# Altium schematic sheet Power.SchDoc: Power Supply
size A3; Author: Eladio Delgado Mingorance; CompanyName: bq - Mundo Reader; Organization: bq - Mundo Reader; Revision: 1.4; SheetNumber: 8; SheetTotal: 10
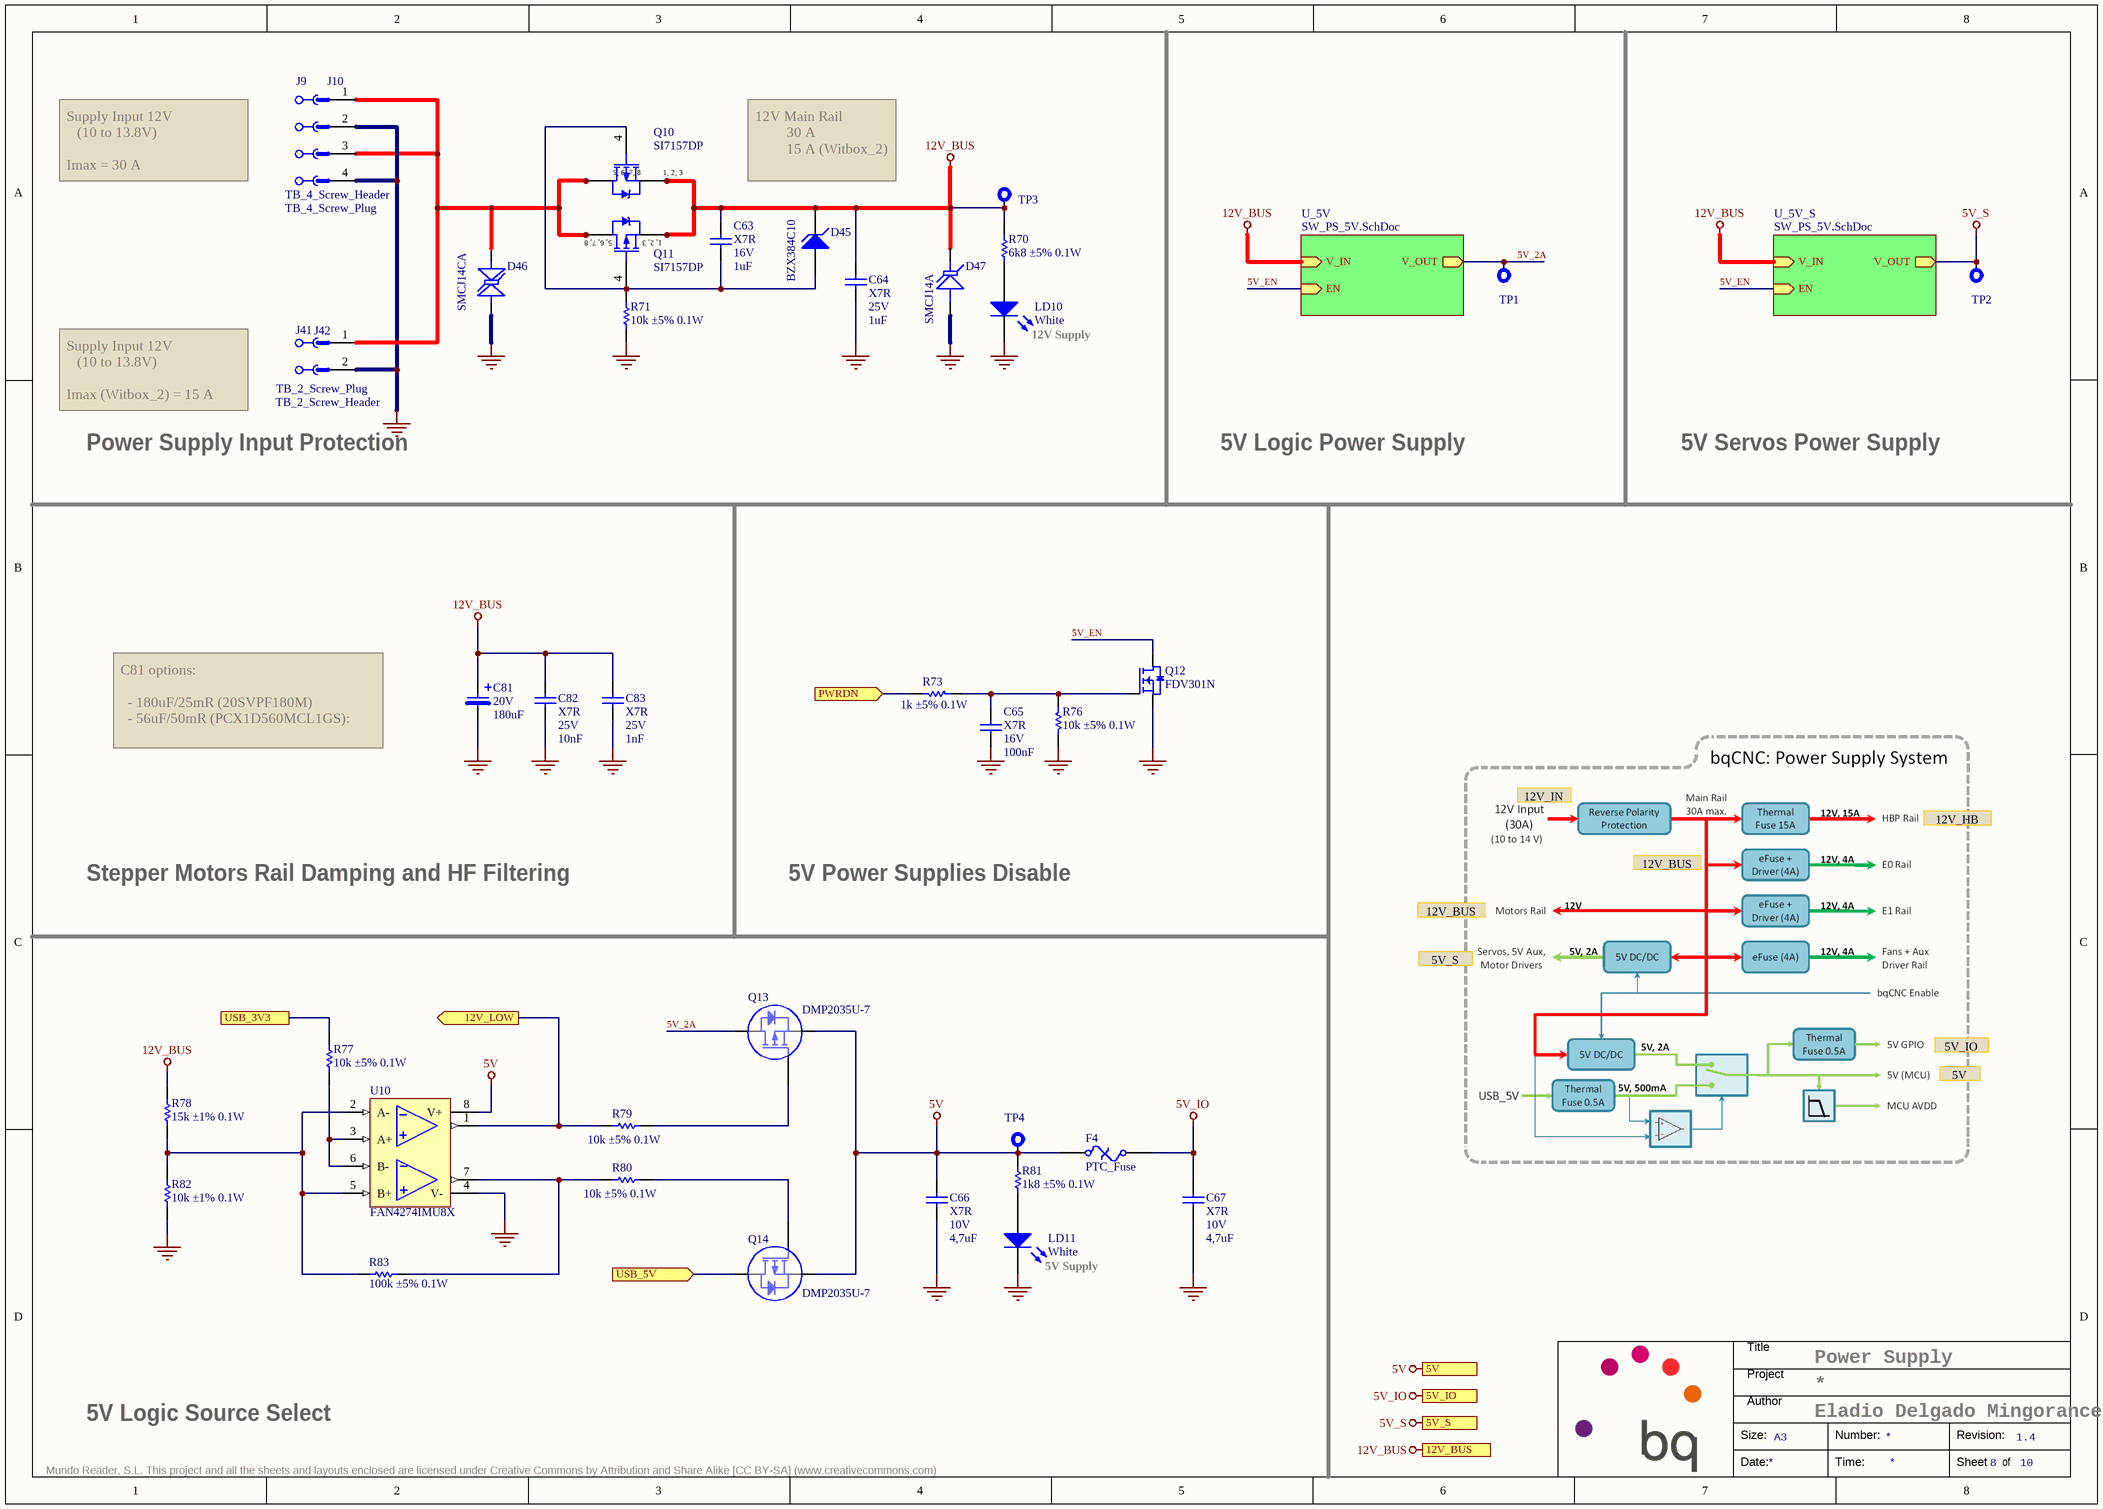
[diagram p0: Power.SchDoc]

## Parts
C63  Dielectric: X7R  Voltage: 16V  Capacitance: 1uF  [C0603]  (hidden comment: Capacitor)
C64  Dielectric: X7R  Voltage: 25V  Capacitance: 1uF  [C0805]  (hidden comment: Capacitor)
C65  Dielectric: X7R  Voltage: 16V  Capacitance: 100nF  [C0603]  (hidden comment: Capacitor)
C66  Dielectric: X7R  Voltage: 10V  Capacitance: 4,7uF  [C0805]  (hidden comment: Capacitor)
C67  Dielectric: X7R  Voltage: 10V  Capacitance: 4,7uF  [C0805]  (hidden comment: Capacitor)
C81  Voltage: 20V  Capacitance: 180uF  [CASE_E7]  (hidden comment: Electrolytic)
C82  Dielectric: X7R  Voltage: 25V  Capacitance: 10nF  [C0603]  (hidden comment: Capacitor)
C83  Dielectric: X7R  Voltage: 25V  Capacitance: 1nF  [C0603]  (hidden comment: Capacitor)
D45  BZX384C10  [SOD323]
D46  SMCJ14CA  [DO-214AB-SMC]
D47  SMCJ14A  [DO-214AB-SMC]
F4  PTC_Fuse  [F1812]
J9  TB_4_Screw_Plug  [TB_RA_4_5.08_Plug]
J10  TB_4_Screw_Header  [TB_RA_4_5.08]
J41  TB_2_Screw_Plug  [TB_RA_2_5.08_Plug]
J42  TB_2_Screw_Header  [TB_RA_2_5.08]
LD10  White  [LED0603]
LD11  White  [LED0603]
Q10  SI7157DP  [AO_DFN5x6]
Q11  SI7157DP  [AO_DFN5x6]
Q12  FDV301N  [SOT23-3]
Q13  DMP2035U-7  [SOT23-3]
Q14  DMP2035U-7  [SOT23-3]
R70  value 6k8 ±5% 0.1W  [R0603]  (hidden comment: Resistor)
R71  value 10k ±5% 0.1W  [R0603]  (hidden comment: Resistor)
R73  value 1k ±5% 0.1W  [R0603]  (hidden comment: Resistor)
R76  value 10k ±5% 0.1W  [R0603]  (hidden comment: Resistor)
R77  value 10k ±5% 0.1W  [R0603]  (hidden comment: Resistor)
R78  value 15k ±1% 0.1W  [R0603]  (hidden comment: Resistor)
R79  value 10k ±5% 0.1W  [R0603]  (hidden comment: Resistor)
R80  value 10k ±5% 0.1W  [R0603]  (hidden comment: Resistor)
R81  value 1k8 ±5% 0.1W  [R0603]  (hidden comment: Resistor)
R82  value 10k ±1% 0.1W  [R0603]  (hidden comment: Resistor)
R83  value 100k ±5% 0.1W  [R0603]  (hidden comment: Resistor)
TP1  Testpoint  [TP_SMD_1mm]  (value not drawn)  (no BOM)
TP2  Testpoint  [TP_SMD_1mm]  (value not drawn)  (no BOM)
TP3  Testpoint  [TP_SMD_1mm]  (value not drawn)  (no BOM)
TP4  Testpoint  [TP_SMD_1mm]  (value not drawn)  (no BOM)
U10  FAN4274IMU8X  [VSSOP8]

## Sub-sheets
U_5V = SW_PS_5V.SchDoc: V_IN (in), V_OUT (out), EN (in)
U_5V_S = SW_PS_5V.SchDoc: V_IN (in), V_OUT (out), EN (in)

## Ports
5V, 5V_IO, 5V_S, 12V_BUS, 12V_LOW (out), PWRDN (in), USB_3V3, USB_5V (in)

## Nets
5V: C66.2 F4.1 Q13.2(S) Q14.2(S) R81.2 TP4.1 U10.8(V+) ; port 5V
5V_IO: C67.2 F4.2 ; port 5V_IO
5V_S: TP2.1 ; port 5V_S, sheet U_5V_S/V_OUT
12V_BUS: C63.2 C64.2 C81.1 C82.2 C83.2 D45.k(K) D47.K Q10.1(S) Q10.2(S) Q10.3(S) Q11.1(S) Q11.2(S) Q11.3(S) R70.2 R78.2 TP3.1 ; port 12V_BUS, sheet U_5V/V_IN, sheet U_5V_S/V_IN
GND: C64.1 C65.1 C66.1 C67.1 C81.2 C82.1 C83.1 D46.A D47.A J10.2 J10.4 J42.2 LD10.K LD11.K Q12.2(S) R71.1 R76.2 R82.1 U10.4(V-)
5V_2A: Q13.3(D) TP1.1 ; sheet U_5V/V_OUT
5V_EN: Q12.3(D) ; sheet U_5V/EN, sheet U_5V_S/EN
12V_LOW: R79.2 U10.1(OutA) ; port 12V_LOW
PWRDN: R73.2 ; port PWRDN
USB_3V3: R77.2 ; port USB_3V3
USB_5V: Q14.3(D) ; port USB_5V
NetC63_1: C63.1 D45.A Q10.4(G) Q11.4(G) R71.2
NetC65_2: C65.2 Q12.1(G) R73.1 R76.1
NetD46_K: D46.K J10.1 J10.3 J42.1 Q10.5(D) Q10.6(D) Q10.7(D) Q10.8(D) Q11.5(D) Q11.6(D) Q11.7(D) Q11.8(D)
NetLD10_A: LD10.A R70.1
NetLD11_A: LD11.A R81.1
NetQ13_1: Q13.1(G) R79.1
NetQ14_1: Q14.1(G) R80.1
NetR77_1: R77.1 U10.3(A+) U10.6(B-)
NetR78_1: R78.1 R82.2 R83.1 U10.2(A-) U10.5(B+)
NetR80_2: R80.2 R83.2 U10.7(OutB)

## Notes on the sheet
- Supply Input 12V
  (10 to 13.8V)
  Imax = 30 A
- 12V Main Rail
  30 A
  15 A (Witbox_2)
- (near LD10) 12V Supply
- Supply Input 12V
  (10 to 13.8V)
  Imax (Witbox_2) = 15 A
- Power Supply Input Protection
- 5V Logic Power Supply
- 5V Servos Power Supply
- C81 options:
  - 180uF/25mR (20SVPF180M)
  - 56uF/50mR (PCX1D560MCL1GS):
- 12V_IN
- 12V_HB
- Stepper Motors Rail Damping and HF Filtering
- 5V Power Supplies Disable
- 12V_BUS
- 5V_S
- 5V_IO
- 5V
- (near LD11) 5V Supply
- 5V Logic Source Select
- Title
- Project
- Size:
- Author
- A3
- Number:
- Revision:
- Mundo Reader, S.L. This project and all the sheets and layouts enclosed are licensed under Creative Commons by Attribution and Share Alike [CC BY-SA] (www.creativecommons.com)
- Date:
- Time:
- Sheet
- of
- (in symbol SI7157DP) 5, 6, 7, 8; 1, 2, 3

## Library data of the parts
C63 = C0603_1uF_16V_±10%_X7R: Manufacturer: TDK; Value: 1uF ±10% 16V; Tolerance: ±10%; OrderingCode: C1608X7R1C105K080AC; Temp_ Max: 125; Temp_ Min: -55; OrderingCode 2: C0603C105K4RACTU; Part Number: C0603_1uF_16V_±10%_X7R; Price (€): 0,018; Manufacturer 2: Kemet
C64 = C0805_1uF_25V_X7R: Manufacturer: TDK; Value: 1uF ±10% 25V; Tolerance: ±10%; OrderingCode: C2012X7R1E105K125AB; Temp_ Max: 125; Temp_ Min: -55; Part Number: C0805_1uF_25V_X7R; Price (€): 0,024
C65 = C0603_100nF_16V_±10%: Manufacturer: Kemet; Value: 100nF ±10% 16V; Tolerance: ±10%; OrderingCode: C0603C104K4RAC; Temp_ Max: 125; Temp_ Min: -55; Part Number: C0603_100nF_16V_±10%; Price (€): 0,012
C66 C67 = C0805_4,7uF_10V_X7R: Manufacturer: TDK; Value: 4,7uF ±10% 10V; Tolerance: ±10%; OrderingCode: C2012X7R1A475K125AC; Temp_ Max: 125; Temp_ Min: -55; Part Number: C0805_4,7uF_10V_X7R; Price (€): 0,041
C81 = Cap_Al_180uF_20V: Capacitor, Electrolytic, SMD; Manufacturer: Panasonic; Value: 180uF 20V; OrderingCode: 20SVPF180M; Temp_ Max: 105; Temp_ Min: -55; Part Number: Cap_Al_180uF_20V; Price (€): 0,69
C82 = C0603_10nF_25V_±10%: Capacitor SMD; Manufacturer: Kemet; Value: 10nF ±10% 25V; Tolerance: ±10%; OrderingCode: C0603C103K3RAC; Temp_ Max: 125; Temp_ Min: -55; Part Number: C0603_10nF_25V_±10%; Price (€): 0,035
C83 = C0603_1nF_25V_±10%: Capacitor SMD; Manufacturer: Kemet; Value: 1nF ±10% 25V; Tolerance: ±10%; OrderingCode: C0603C102K3RAC; Temp_ Max: 125; Temp_ Min: -55; Part Number: C0603_1nF_25V_±10%; Price (€): 0,058
D45 = BZX384C10: Diode Zener; Manufacturer: Vishay; Vzener: 10V; Tolerance: 0,05; Izener: 5mA; Power: 200mW; OrderingCode: BZX384C10-E3-18; Temp_ Max: 150; Temp_ Min: -55; OrderingCode 2: BZX384B10-E3-18; Value: 10V; Part Number: BZX384C10; Price (€): 0,024; Manufacturer 2: Vishay
D46 = TVS 14V Bidir SMC: Transient Suppression Diodes Bidirectional; Manufacturer: Fairchild Semiconductor; Voltage: 14V; Breakdown Voltage: 15,6V; Overvoltage Current: 64,7A; Temp_ Max: 150; Temp_ Min: -55; Part Number: TVS 14V Bidir SMC; OrderingCode: SMCJ14CA; Price (€): 0,158; Manufacturer 2: Littelfuse; OrderingCode 2: SMCJ14CA
D47 = TVS 14V SMC: Transient Suppression Diodes; Manufacturer: Fairchild Semiconductor; Voltage: 14V; Breakdown Voltage: 15,6V; Overvoltage Current: 64,7A; Temp_ Max: 150; Temp_ Min: -55; Part Number: TVS 14V SMC; OrderingCode: SMCJ14A; Price (€): 0,134; Manufacturer 2: Littelfuse; OrderingCode 2: SMCJ14A
F4 = FUSE 0.5A 15V: PTC Resettable Fuse; Manufacturer: Bourns; Voltage: 15V; Current: 0.5A; OrderingCode: MF-MSMF050-2; Temp_ Max: 85; Temp_ Min: -40; Part Number: FUSE 0.5A 15V; Price (€): 0,108; Supplier: Abacus
J9 = TB_4_RA_Plug_5.08: Connector, Plugable Terminal  Block  - Plug 4p; Manufacturer: Molex; OrderingCode: 39530-0104; Temp_Max: 105; Temp_Min: -40; Value: 4; Part Number: TB_4_RA_Plug_5.08; Price (€): 1,39
J10 = TB_4_RA_Header_5.08: Connector, Plugable Terminal  Block  - Header 4p; Manufacturer: Molex; OrderingCode: 39532-1004; Temp_Max: 105; Temp_Min: -40; Value: 4; Part Number: TB_4_RA_Header_5.08; Price (€): 0,403
J41 = TB_2_RA_Plug_5.08: Connector, Plugable Terminal  Block  - Plug 2p; Manufacturer: Molex; OrderingCode: 39530-0102; Temp_Max: 115; Temp_Min: -40; Value: 2; Part Number: TB_2_RA_Plug_5.08; Price (€): 0,528
J42 = TB_2_RA_Header_5.08: Connector, Plugable Terminal  Block  - Header 2p; Manufacturer: Molex; OrderingCode: 39532-1002; Temp_Max: 115; Temp_Min: -40; Value: 2; Part Number: TB_2_RA_Header_5.08; Price (€): 0,239
LD10 LD11 = LW Q38G-Q2R3: LED; Manufacturer: OSRAM Opto; OrderingCode: LW Q38G-Q2R2-3K5L-1; Temp_ Max: 85; Temp_ Min: -40; Part Number: LW Q38G-Q2R3; Price (€): 0,1; Value: White
Q10 Q11 = SI7157DP: PFET Power SO8; Manufacturer: Vishay; Vds: 20V; Vgss: 12V; Id: 60A; OrderingCode: SI7157DP-T1-GE3; Temp_ Max: 150; Temp_ Min: -55; Part Number: SI7157DP; Price (€): 0,605
Q12 = FDV301N: Mosfet Channel N Enhancement Mode; Manufacturer: Fairchild Semiconductor; Vds: 25V; Vgss: 8V; Id: 0,22A; Temp_ Max: 150; Temp_ Min: -55; OrderingCode 2: DMG301NU-13; Part Number: FDV301N; OrderingCode: FDV301N; Price (€): 0,026; Manufacturer 2: Diode
Q13 Q14 = DMP2035U: Mosfet Channel P Enhancement Mode; Manufacturer: Diodes Incorporated; Vds: 20V; Vgss: 8V; Id: 3,6A; Temp_ Max: 150; Temp_ Min: -55; Part Number: DMP2035U; OrderingCode: DMP2035U-7; Price (€): 0,08; Supplier: Silica
R70 = R0603_6k8_0.1W_±5%: Resistor, SMD; Manufacturer: Vishay; Tolerance: ±5%; OrderingCode: CRCW06036K80JN; Power: 0.1W; Resistance: 6k8; Temp_ Max: 155; Temp_ Min: -55; PackageDescription: SMD; Part Number: R0603_6k8_0.1W_±5%; Price (€): 0,003
R71 R76 R77 R79 R80 = R0603_10k_0.1W_±5%: Manufacturer: Vishay; Tolerance: ±5%; OrderingCode: CRCW060310K0JN; Power: 0.1W; Resistance: 10k; Temp_ Max: 155; Temp_ Min: -55; PackageDescription: SMD; Part Number: R0603_10k_0.1W_±5%; Price (€): 0,003
R73 = R0603_1k_0.1W_±5%: Manufacturer: Vishay; Tolerance: ±5%; OrderingCode: CRCW06031K00JN; Power: 0.1W; Resistance: 1k; Temp_ Max: 155; Temp_ Min: -55; PackageDescription: SMD; Part Number: R0603_1k_0.1W_±5%; Price (€): 0,003
R78 = R0603_15k_0.1W_±1%: Manufacturer: Vishay; Tolerance: ±1%; OrderingCode: CRCW060315K0FK; Power: 0.1W; Resistance: 15k; Temp_ Max: 155; Temp_ Min: -55; PackageDescription: SMD; Part Number: R0603_15k_0.1W_±1%; Price (€): 0,014
R81 = R0603_1k8_0.1W_±5%: Resistor, SMD; Manufacturer: Vishay; Tolerance: ±5%; OrderingCode: CRCW06031K80JN; Power: 0.1W; Resistance: 1k8; Temp_ Max: 155; Temp_ Min: -55; PackageDescription: SMD; Part Number: R0603_1k8_0.1W_±5%; Price (€): 0,003
R82 = R0603_10k_0.1W_±1%: Manufacturer: Vishay; Tolerance: ±1%; OrderingCode: CRCW060310K0FK; Power: 0.1W; Resistance: 10k; Temp_ Max: 155; Temp_ Min: -55; PackageDescription: SMD; Part Number: R0603_10k_0.1W_±1%; Price (€): 0,014
R83 = R0603_100k_0.1W_±5%: Manufacturer: Vishay; Tolerance: ±5%; OrderingCode: CRCW0603100KJN; Power: 0.1W; Resistance: 100k; Temp_ Max: 155; Temp_ Min: -55; PackageDescription: SMD; Part Number: R0603_100k_0.1W_±5%; Price (€): 0,003
TP1-TP4 = TP_SMD_1mm: SAP: 303552; Part Number: TP_SMD_1mm
U10 = FAN4274: Operational Amplifier Dual 3.7MHz; Manufacturer: Fairchild Semiconductor; Vdc: 2,3 - 5,25 V; Temp_ Max: 125; Temp_ Min: -40; Part Number: FAN4274; OrderingCode: FAN4274IMU8X; Price (€): 0,245